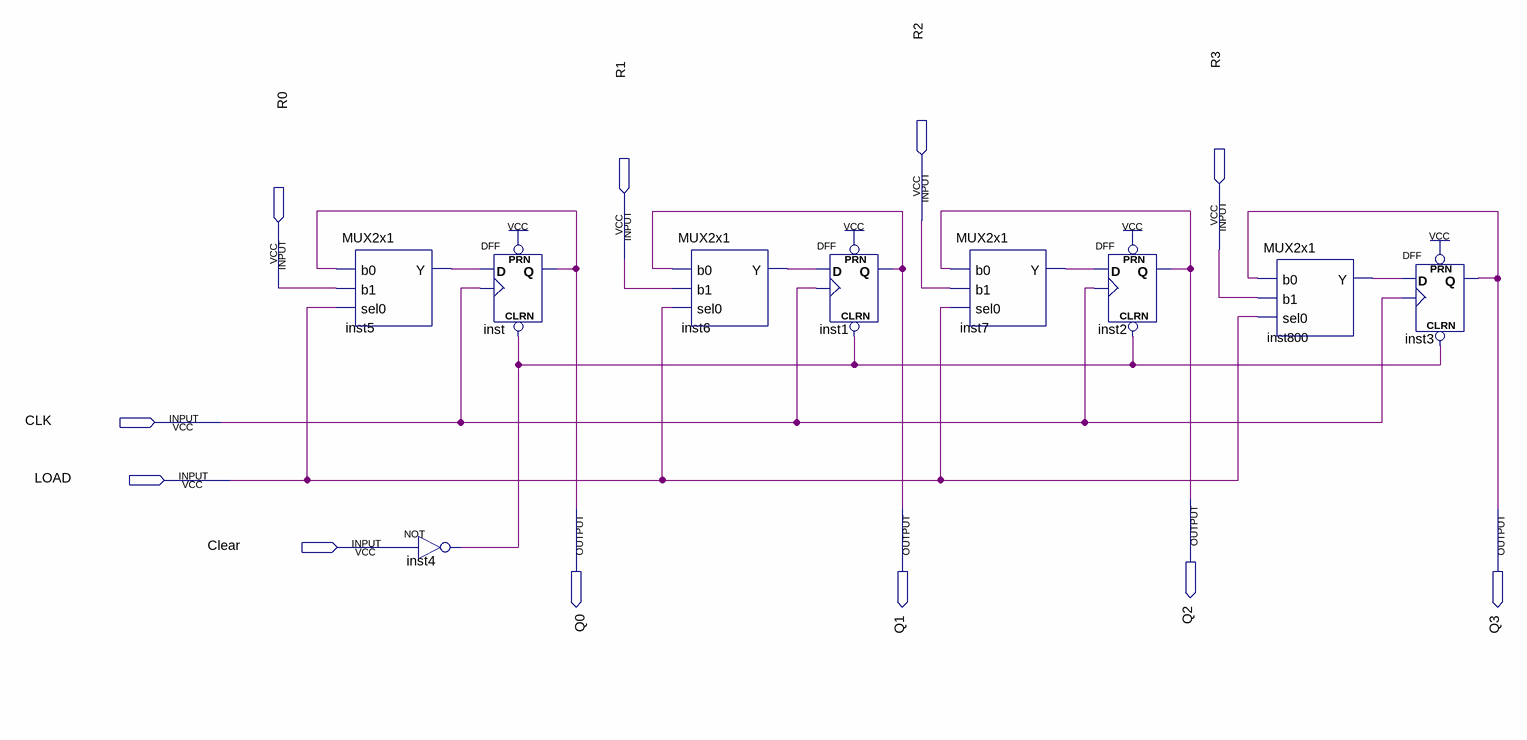
[diagram p0: schematic sheet]
// Quartus schematic registrador.bdf as structural Verilog: 9 symbols, 11 pins
module registrador (
  input  R2,
  input  R3,
  input  R1,
  input  R0,
  input  CLK,
  input  LOAD,
  input  Clear,
  output Q2,
  output Q0,
  output Q1,
  output Q3
);

  wire inst4_out, inst5_y, inst6_y, inst7_y, inst800_y;

  MUX2x1 inst5 (.b0(Q0), .b1(R0), .sel0(LOAD), .Y(inst5_y));
  not inst4 (inst4_out, Clear);
  DFF inst (.CLRN(inst4_out), .CLK(CLK), .D(inst5_y), .PRN(1'b1), .Q(Q0));
  MUX2x1 inst6 (.b0(Q1), .b1(R1), .sel0(LOAD), .Y(inst6_y));
  DFF inst1 (.CLRN(inst4_out), .CLK(CLK), .D(inst6_y), .PRN(1'b1), .Q(Q1));
  MUX2x1 inst7 (.b0(Q2), .b1(R2), .sel0(LOAD), .Y(inst7_y));
  DFF inst2 (.CLRN(inst4_out), .CLK(CLK), .D(inst7_y), .PRN(1'b1), .Q(Q2));
  MUX2x1 inst800 (.b0(Q3), .b1(R3), .sel0(LOAD), .Y(inst800_y));
  DFF inst3 (.CLRN(inst4_out), .CLK(CLK), .D(inst800_y), .PRN(1'b1), .Q(Q3));
endmodule
